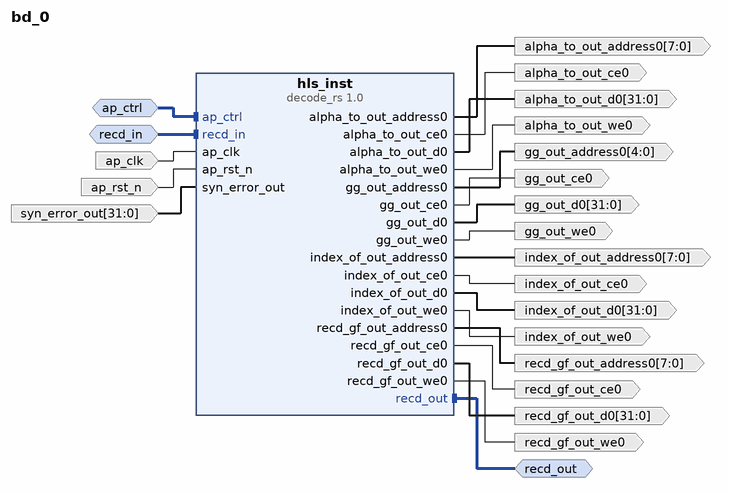
[diagram p0: block diagram of the top level]
# Vivado block design bd_0, xcvu37p-fsvh2892-2L-e, Vivado 2020.2
create_bd_design bd_0

create_bd_intf_port -mode Slave -vlnv xilinx.com:interface:acc_handshake_rtl:1.0 ap_ctrl
create_bd_intf_port -mode Slave -vlnv xilinx.com:interface:axis_rtl:1.0 recd_in
set_property -dict [list \
  CONFIG.FREQ_HZ 100000000.0 \
  CONFIG.HAS_TKEEP 0 \
  CONFIG.HAS_TLAST 0 \
  CONFIG.HAS_TREADY 1 \
  CONFIG.HAS_TSTRB 0 \
  CONFIG.LAYERED_METADATA undef \
  CONFIG.TDATA_NUM_BYTES 4 \
  CONFIG.TDEST_WIDTH 0 \
  CONFIG.TID_WIDTH 0 \
  CONFIG.TUSER_WIDTH 0 \
] [get_bd_intf_ports recd_in]
create_bd_intf_port -mode Master -vlnv xilinx.com:interface:axis_rtl:1.0 recd_out
set_property -dict {CONFIG.FREQ_HZ 100000000.0} [get_bd_intf_ports recd_out]
create_bd_port -dir O -from 7 -to 0 -type data alpha_to_out_address0
create_bd_port -dir O alpha_to_out_ce0
create_bd_port -dir O -from 31 -to 0 -type data alpha_to_out_d0
create_bd_port -dir O alpha_to_out_we0
create_bd_port -dir I -type clk ap_clk
set_property -dict {CONFIG.FREQ_HZ 100000000.0} [get_bd_ports ap_clk]
create_bd_port -dir I -type rst ap_rst_n
create_bd_port -dir O -from 4 -to 0 -type data gg_out_address0
create_bd_port -dir O gg_out_ce0
create_bd_port -dir O -from 31 -to 0 -type data gg_out_d0
create_bd_port -dir O gg_out_we0
create_bd_port -dir O -from 7 -to 0 -type data index_of_out_address0
create_bd_port -dir O index_of_out_ce0
create_bd_port -dir O -from 31 -to 0 -type data index_of_out_d0
create_bd_port -dir O index_of_out_we0
create_bd_port -dir O -from 7 -to 0 -type data recd_gf_out_address0
create_bd_port -dir O recd_gf_out_ce0
create_bd_port -dir O -from 31 -to 0 -type data recd_gf_out_d0
create_bd_port -dir O recd_gf_out_we0
create_bd_port -dir I -from 31 -to 0 -type data syn_error_out

create_bd_cell -type ip -vlnv xilinx.com:hls:decode_rs:1.0 hls_inst

# ---- connections ----

connect_bd_intf_net -intf_net ap_ctrl_0_1 [get_bd_intf_ports ap_ctrl] [get_bd_intf_pins hls_inst/ap_ctrl]
connect_bd_intf_net -intf_net recd_in_0_1 [get_bd_intf_ports recd_in] [get_bd_intf_pins hls_inst/recd_in]
connect_bd_intf_net [get_bd_intf_ports recd_out] [get_bd_intf_pins hls_inst/recd_out]
connect_bd_net [get_bd_pins hls_inst/alpha_to_out_address0] [get_bd_ports alpha_to_out_address0]
connect_bd_net [get_bd_pins hls_inst/alpha_to_out_ce0] [get_bd_ports alpha_to_out_ce0]
connect_bd_net [get_bd_pins hls_inst/alpha_to_out_d0] [get_bd_ports alpha_to_out_d0]
connect_bd_net [get_bd_pins hls_inst/alpha_to_out_we0] [get_bd_ports alpha_to_out_we0]
connect_bd_net -net ap_clk_0_1 [get_bd_ports ap_clk] [get_bd_pins hls_inst/ap_clk]
connect_bd_net -net ap_rst_n_0_1 [get_bd_ports ap_rst_n] [get_bd_pins hls_inst/ap_rst_n]
connect_bd_net [get_bd_pins hls_inst/gg_out_address0] [get_bd_ports gg_out_address0]
connect_bd_net [get_bd_pins hls_inst/gg_out_ce0] [get_bd_ports gg_out_ce0]
connect_bd_net [get_bd_pins hls_inst/gg_out_d0] [get_bd_ports gg_out_d0]
connect_bd_net [get_bd_pins hls_inst/gg_out_we0] [get_bd_ports gg_out_we0]
connect_bd_net [get_bd_pins hls_inst/index_of_out_address0] [get_bd_ports index_of_out_address0]
connect_bd_net [get_bd_pins hls_inst/index_of_out_ce0] [get_bd_ports index_of_out_ce0]
connect_bd_net [get_bd_pins hls_inst/index_of_out_d0] [get_bd_ports index_of_out_d0]
connect_bd_net [get_bd_pins hls_inst/index_of_out_we0] [get_bd_ports index_of_out_we0]
connect_bd_net [get_bd_pins hls_inst/recd_gf_out_address0] [get_bd_ports recd_gf_out_address0]
connect_bd_net [get_bd_pins hls_inst/recd_gf_out_ce0] [get_bd_ports recd_gf_out_ce0]
connect_bd_net [get_bd_pins hls_inst/recd_gf_out_d0] [get_bd_ports recd_gf_out_d0]
connect_bd_net [get_bd_pins hls_inst/recd_gf_out_we0] [get_bd_ports recd_gf_out_we0]
connect_bd_net -net syn_error_out_0_1 [get_bd_ports syn_error_out] [get_bd_pins hls_inst/syn_error_out]

validate_bd_design
save_bd_design
